# Altium project PCB_V2.0_Altium.PrjPcb
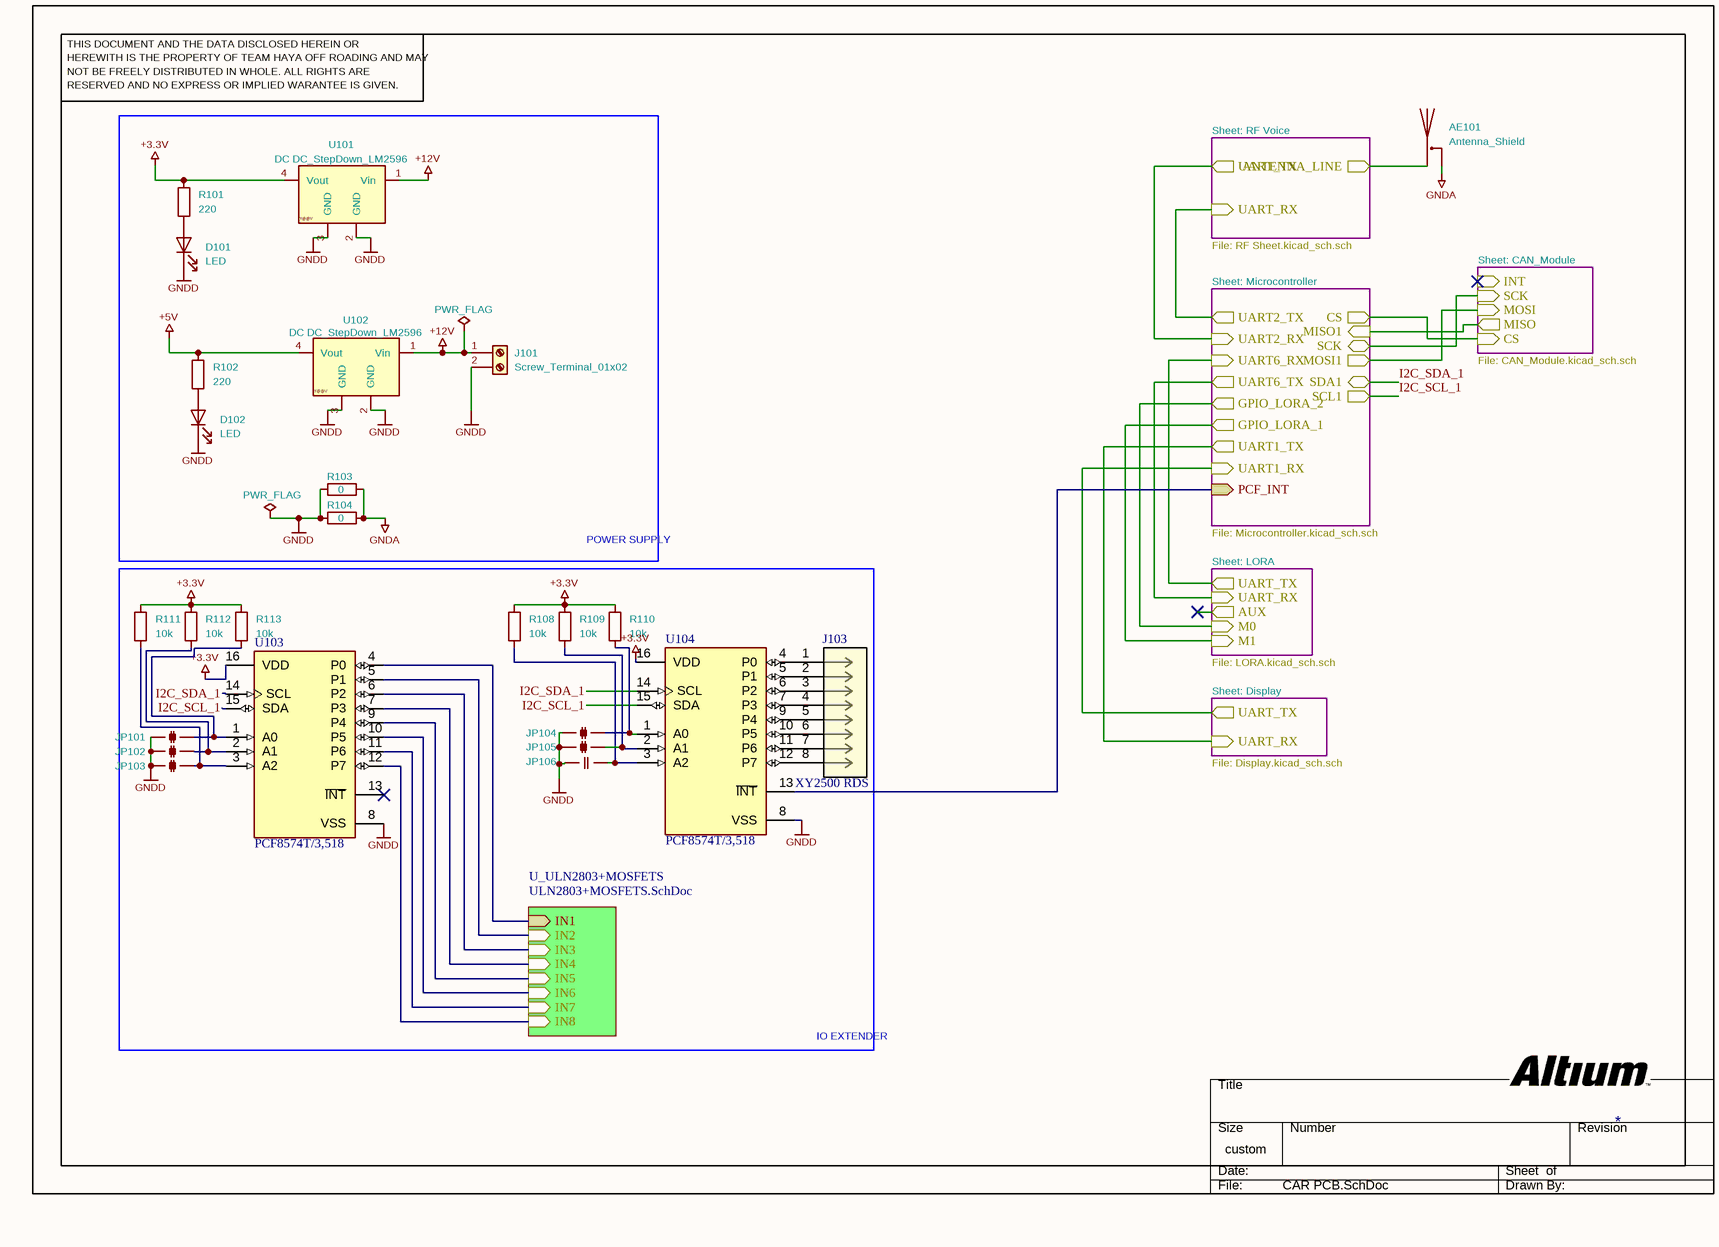
[diagram p0: CAR PCB.SchDoc]
7 sheets, 103 parts. Net scope: hierarchical (ports join the sheet entries above them; power ports are global).
Board file: PCBV2-01.PcbDoc
Sheets:
  CAR PCB.SchDoc
    Display = Display.SchDoc
    RF Voice = RF Sheet.SchDoc
    CAN_Module = CAN_Module.SchDoc
    LORA = LORA.SchDoc
    Microcontroller = Microcontroller.SchDoc
    U_ULN2803+MOSFETS = ULN2803+MOSFETS.SchDoc

## Sheet CAR PCB.SchDoc
size 297 x 209 mm

### Parts
#FLG0102  PWR_FLAG  (graphical)
#FLG0103  PWR_FLAG  (graphical)
AE101  Antenna_Shield  [132134_AMP]
D101  LED  [LED_1206_3216Metric_Pad1.42x1.75mm_HandSolder]
D102  LED  [LED_1206_3216Metric_Pad1.42x1.75mm_HandSolder]
J101  Screw_Terminal_01x02  [TerminalBlock_Phoenix_MKDS-3-2-5.08_1x02_P5.08mm_Horizontal]
J103  XY2500 RDS  [TerminalBlock_Phoenix_MKDS-1,5-8-5.08_1x08_P5.08mm_Horizontal]
JP101  SolderJumper_2_Bridged  [R_0603_1608Metric_Pad0.98x0.95mm_HandSolder]  (value not drawn)
JP102  SolderJumper_2_Bridged  [R_0603_1608Metric_Pad0.98x0.95mm_HandSolder]  (value not drawn)
JP103  SolderJumper_2_Bridged  [R_0603_1608Metric_Pad0.98x0.95mm_HandSolder]  (value not drawn)
JP104  SolderJumper_2_Bridged  [R_0603_1608Metric_Pad0.98x0.95mm_HandSolder]  (value not drawn)
JP105  SolderJumper_2_Bridged  [R_0603_1608Metric_Pad0.98x0.95mm_HandSolder]  (value not drawn)
JP106  SolderJumper_2_Open  [R_0603_1608Metric_Pad0.98x0.95mm_HandSolder]  (value not drawn)
R101  220  [R_0805_2012Metric_Pad1.20x1.40mm_HandSolder]
R102  220  [R_0805_2012Metric_Pad1.20x1.40mm_HandSolder]
R103  0  [R_1206_3216Metric_Pad1.30x1.75mm_HandSolder]
R104  0  [R_1206_3216Metric_Pad1.30x1.75mm_HandSolder]
R108  10k  [R_1206_3216Metric_Pad1.30x1.75mm_HandSolder]
R109  value 10k  [R_1206_3216Metric_Pad1.30x1.75mm_HandSolder]  (hidden comment: 1k)
R110  value 10k  [R_1206_3216Metric_Pad1.30x1.75mm_HandSolder]  (hidden comment: 1k)
R111  value 10k  [R_1206_3216Metric_Pad1.30x1.75mm_HandSolder]  (hidden comment: 1k)
R112  value 10k  [R_1206_3216Metric_Pad1.30x1.75mm_HandSolder]  (hidden comment: 1k)
R113  value 10k  [R_1206_3216Metric_Pad1.30x1.75mm_HandSolder]  (hidden comment: 1k)
U101  DC DC_StepDown_LM2596  [YAAJ_DCDC_StepDown_LM2596]
U102  DC DC_StepDown_LM2596  [YAAJ_DCDC_StepDown_LM2596]
U103  PCF8574T/3,518  [FP-SOT162-1-MFG]
U104  PCF8574T/3,518  [FP-SOT162-1-MFG]

### Blocks framed on the sheet
POWER SUPPLY: #FLG0102 #FLG0103 D101 D102 J101 R101-R104 U101 U102
IO EXTENDER: J103 JP101-JP106 R108-R113 U103 U104

### Sub-sheets
CAN_Module = CAN_Module.SchDoc: INT (in), SCK (in), MOSI (in), MISO (out), CS (in)
Display = Display.SchDoc: UART_TX (out), UART_RX (in)
LORA = LORA.SchDoc: AUX (out), UART_RX (in), UART_TX (out), M0 (in), M1 (in)
Microcontroller = Microcontroller.SchDoc: UART2_TX (out), UART2_RX (in), UART6_RX (in), UART6_TX (out), GPIO_LORA_2 (out), GPIO_LORA_1 (out), UART1_TX (out), UART1_RX (in), CS (out), MISO1 (in), SCK (bidir), MOSI1 (out), SDA1 (bidir), SCL1 (out), PCF_INT (in)
RF Voice = RF Sheet.SchDoc: UART_TX (out), UART_RX (in), ANTENNA_LINE (out)
U_ULN2803+MOSFETS = ULN2803+MOSFETS.SchDoc: IN3 (in), IN5 (in), IN2 (in), IN6 (in), IN8 (in), IN4 (in), IN7 (in), IN1 (in)

### Nets
+3.3V: R101.1 R108.1 R109.1 R110.1 R111.1 R112.1 R113.1 U101.4(Vout) U103.16(VDD) U104.16(VDD)
+5V: R102.1 U102.4(Vout)
+12V: #FLG0103.1 J101.1(Pin_1) U101.1(Vin) U102.1(Vin)
GNDA: AE101.2(Shield) R103.2 R104.2
GNDD: #FLG0102.1 D101.1(K) D102.1(K) J101.2(Pin_2) JP101.1(A) JP102.1(A) JP103.1(A) JP104.1(A) JP105.1(A) JP106.1(A) R103.1 R104.1 U101.2(GND) U101.3(GND) U102.2(GND) U102.3(GND) U103.8(VSS) U104.8(VSS)
ANTENNA_LINE: AE101.1(A) ; sheet RF Voice/ANTENNA_LINE
CS: sheet CAN_Module/CS, sheet Microcontroller/CS
GPIO_LORA_1: sheet LORA/M1, sheet Microcontroller/GPIO_LORA_1
GPIO_LORA_2: sheet LORA/M0, sheet Microcontroller/GPIO_LORA_2
I2C_SCL_1: U103.15(SDA) U104.15(SDA) ; sheet Microcontroller/SCL1
I2C_SDA_1: U103.14(SCL) U104.14(SCL) ; sheet Microcontroller/SDA1
IN1: U103.4(P0) ; sheet U_ULN2803+MOSFETS/IN1
IN2: U103.5(P1) ; sheet U_ULN2803+MOSFETS/IN2
IN3: U103.6(P2) ; sheet U_ULN2803+MOSFETS/IN3
IN4: U103.7(P3) ; sheet U_ULN2803+MOSFETS/IN4
IN5: U103.9(P4) ; sheet U_ULN2803+MOSFETS/IN5
IN6: U103.10(P5) ; sheet U_ULN2803+MOSFETS/IN6
IN7: U103.11(P6) ; sheet U_ULN2803+MOSFETS/IN7
IN8: U103.12(P7) ; sheet U_ULN2803+MOSFETS/IN8
MISO: sheet CAN_Module/MISO, sheet Microcontroller/MISO1
MOSI: sheet CAN_Module/MOSI, sheet Microcontroller/MOSI1
PCF_INT: U104.13(~{INT}) ; sheet Microcontroller/PCF_INT
SCK: sheet CAN_Module/SCK, sheet Microcontroller/SCK
UART1_RX: sheet Display/UART_TX, sheet Microcontroller/UART1_RX
UART1_TX: sheet Display/UART_RX, sheet Microcontroller/UART1_TX
UART2_RX: sheet RF Voice/UART_TX, sheet Microcontroller/UART2_RX
UART2_TX: sheet RF Voice/UART_RX, sheet Microcontroller/UART2_TX
UART6_RX: sheet LORA/UART_TX, sheet Microcontroller/UART6_RX
UART6_TX: sheet LORA/UART_RX, sheet Microcontroller/UART6_TX
NetD101_2: D101.2(A) R101.2
NetD102_2: D102.2(A) R102.2
NetJ103_1: J103.1 U104.4(P0)
NetJ103_2: J103.2 U104.5(P1)
NetJ103_3: J103.3 U104.6(P2)
NetJ103_4: J103.4 U104.7(P3)
NetJ103_5: J103.5 U104.9(P4)
NetJ103_6: J103.6 U104.10(P5)
NetJ103_7: J103.7 U104.11(P6)
NetJ103_8: J103.8 U104.12(P7)
NetJP101_2: JP101.2(B) R113.2 U103.1(A0)
NetJP102_2: JP102.2(B) R112.2 U103.2(A1)
NetJP103_2: JP103.2(B) R111.2 U103.3(A2)
NetJP104_2: JP104.2(B) R110.2 U104.1(A0)
NetJP105_2: JP105.2(B) R109.2 U104.2(A1)
NetJP106_2: JP106.2(B) R108.2 U104.3(A2)

Not connected (* = marked no-connect by the designer): U103 13(~{INT})*

### Notes on the sheet
- Sheet: RF Voice
- File: RF Sheet.kicad_sch.sch
- Sheet: Microcontroller
- Sheet: CAN_Module
- File: CAN_Module.kicad_sch.sch
- Sheet: LORA
- File: Microcontroller.kicad_sch.sch
- File: LORA.kicad_sch.sch
- Sheet: Display
- File: Display.kicad_sch.sch
- THIS DOCUMENT AND THE DATA DISCLOSED HEREIN OR
- HEREWITH IS THE PROPERTY OF TEAM HAYA OFF ROADING AND MAY
- NOT BE FREELY DISTRIBUTED IN WHOLE. ALL RIGHTS ARE
- RESERVED AND NO EXPRESS OR IMPLIED WARANTEE IS GIVEN.
- (in symbol DCDC_StepDown_LM2596) Y@@V

### Library data of the parts
J103 = 796867-8: No Description Available; Mfr_Name: TE Connectivity; TYPE: Header; RefDes: RefDes
R101-R104 R108-R113 = R
  R101 R102: Value: 220; Footprint: Resistor_SMD:R_0805_2012Metric_Pad1.20x1.40mm_HandSolder
  R103 R104: Value: 0; Footprint: Resistor_SMD:R_1206_3216Metric_Pad1.30x1.75mm_HandSolder
  R108: Value: 10k; Footprint: Resistor_SMD:R_1206_3216Metric_Pad1.30x1.75mm_HandSolder
  R109-R113: Footprint: Resistor_SMD:R_1206_3216Metric_Pad1.30x1.75mm_HandSolder
U101 U102 = DCDC_StepDown_LM2596: Value: DC DC_StepDown_LM2596; Footprint: DC DC Modules:DCDC_StepDown_LM2596
U103 U104 = CMP-10112-000010-1: IC I/O EXPANDER I2C 8B 16SOIC; Manufacturer: NXP Semiconductors; Frequency: 100kHz; Max Supply Voltage: 6V; Standoff Height: 0.1mm; Nominal Supply Current: 40uA; Max Junction Temp: +125°C; Min Supply Voltage: 2.5V; Number Of I/Os: 8; Manufacturer Part Number: PCF8574T/3,518; Footprint Url: https://www.nxp.com/docs/en/package-information/SOT162-1.pdf; ComponentLink2URL: https://www.nxp.com/docs/en/data-sheet/PCF8574_PCF8574A.pdf; Automotive: No; Digikey Description: IC I/O EXPANDER I2C 8B 16SOIC; Mouser Description: PCF8574 Series 2.5 - 6V Remote 8-bit I/O Expander for I2C-bus - SOIC-16; Ipc Land Pattern Name: SOIC127P1032X265-16; Interface: I2C; Octopart: https://octopart.com/pcf8574t%2F3%2C518-nxp+semiconductors-10470852; Ambient Temperature Range Low: -40°C; Lead Free: Yes; Device Class L2: Interface ICs; Temperature Range High: +85°C; Device Class L1: Integrated Circuits (ICs); Package: SOT162-1; ComponentLink2Description: Datasheet; Device Class L3: I/O Expanders; Temperature: -40°C to +85°C; Ambient Temperature Range High: +85°C; Height: 2.65mm; Category: IC; RoHS: TRUE; Temperature Range Low: -40°C
#FLG0102 #FLG0103 = PWR_FLAG: Value: PWR_FLAG
AE101 = Antenna_Shield: Value: Antenna_Shield; Footprint: Connector_Coaxial:SMA_Amphenol_132134-11_Vertical
D101 D102 = LED: Value: LED; Footprint: LED_SMD:LED_1206_3216Metric_Pad1.42x1.75mm_HandSolder
J101 = Screw_Terminal_01x02: Value: Screw_Terminal_01x02; Footprint: TerminalBlock_Phoenix:TerminalBlock_Phoenix_MKDS-3-2-5.08_1x02_P5.08mm_Horizontal
JP101-JP105 = SolderJumper_2_Bridged: Value: SolderJumper_2_Bridged
JP106 = SolderJumper_2_Open: Value: SolderJumper_2_Open

## Sheet Display.SchDoc
size 297 x 209 mm
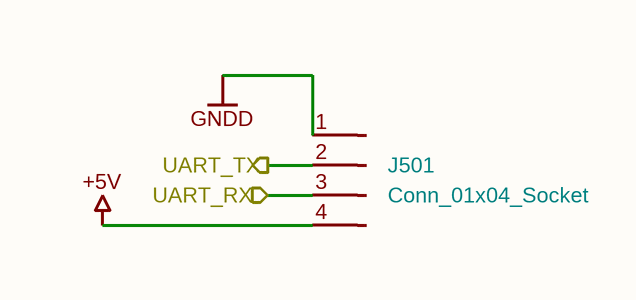
[diagram p1: Display.SchDoc]

### Parts
J501  Conn_01x04_Socket  [JST_XH_B4B-XH-A_1x04_P2.50mm_Vertical]

### Ports
UART_RX (in), UART_TX (out)

### Nets
+5V: J501.4(Pin_4)
GNDD: J501.1(Pin_1)
UART1_RX: J501.2(Pin_2) ; port UART_TX
UART1_TX: J501.3(Pin_3) ; port UART_RX

### Notes on the sheet
- THIS DOCUMENT AND THE DATA DISCLOSED HEREIN OR
- HEREWITH IS THE PROPERTY OF TEAM HAYA OFF ROADING AND MAY
- NOT BE FREELY DISTRIBUTED IN WHOLE. ALL RIGHTS ARE
- RESERVED AND NO EXPRESS OR IMPLIED WARANTEE IS GIVEN.

### Library data of the parts
J501 = Conn_01x04_Socket: Value: Conn_01x04_Socket; Footprint: Connector_JST:JST_XH_B4B-XH-A_1x04_P2.50mm_Vertical

## Sheet RF Sheet.SchDoc
size 297 x 209 mm
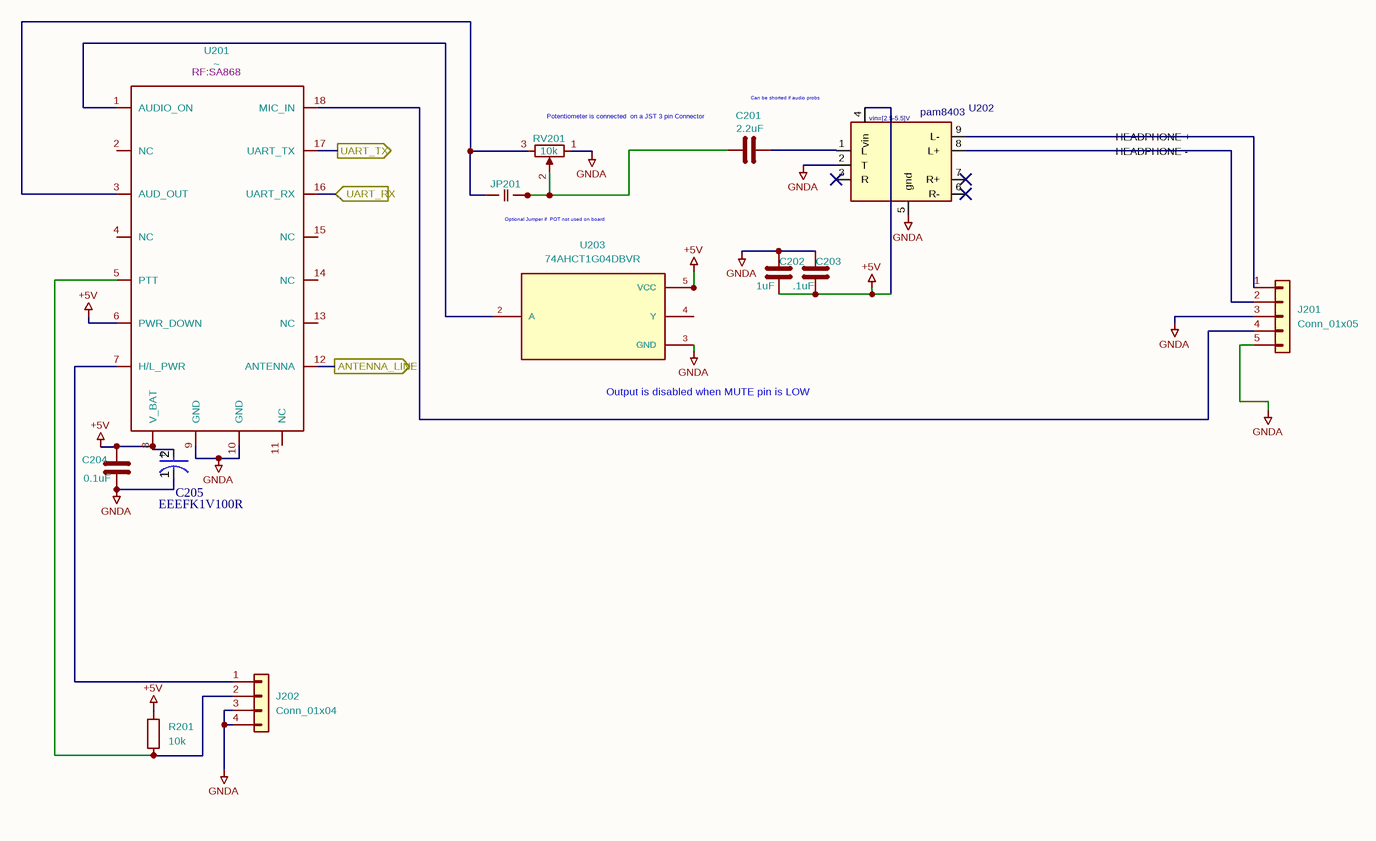
[diagram p2: RF Sheet.SchDoc]

### Parts
C201  2.2uF  [C_0603_1608Metric_Pad1.08x0.95mm_HandSolder]
C202  1uF  [C_0603_1608Metric_Pad1.08x0.95mm_HandSolder]
C203  .1uF  [C_0603_1608Metric_Pad1.08x0.95mm_HandSolder]
C204  0.1uF  [C_0603_1608Metric_Pad1.08x0.95mm_HandSolder]
C205  EEEFK1V100R  [FP-FKC-MFG]
J201  Conn_01x05  [JST_XH_B05B-XH-A_05x2.50mm_Straight]
J202  Conn_01x04  [JST_XH_B4B-XH-A_1x04_P2.50mm_Vertical]
JP201  SolderJumper_2_Open  [R_1206_3216Metric_Pad1.30x1.75mm_HandSolder]  (value not drawn)
R201  10k  [R_1206_3216Metric_Pad1.30x1.75mm_HandSolder]
RV201  10k  [JST_XH_B3B-XH-A_1x03_P2.50mm_Vertical]
U201  Footprint: RF:SA868  [SA868]  (hidden comment: ~)
U202  pam8403  [pam8403]
U203  74AHCT1G04DBVR  [SOT-23-5]

### Ports
ANTENNA_LINE (out), UART_RX (in), UART_TX (out)

### Nets
+5V: C202.2 C203.2 C204.1 C205.2(A) R201.1 U201.6(PWR_DOWN) U201.8(V_BAT) U202.4(vin) U203.5(VCC)
GNDA: C202.1 C203.1 C204.2 C205.1(C) J201.3(Pin_3) J201.5(Pin_5) J202.3(Pin_3) J202.4(Pin_4) RV201.1 U201.9(GND) U201.10(GND) U202.2(T) U202.5(gnd) U203.3(GND)
ANTENNA_LINE: U201.12(ANTENNA) ; port ANTENNA_LINE
UART2_RX: U201.17(UART_TX) ; port UART_TX
UART2_TX: U201.16(UART_RX) ; port UART_RX
NetC201_1: C201.1 JP201.2(B) RV201.2
NetC201_2: C201.2 U202.1(L)
NetJ201_1: J201.1(Pin_1) U202.9(L-)
NetJ201_2: J201.2(Pin_2) U202.8(L+)
NetJ201_4: J201.4(Pin_4) U201.18(MIC_IN)
NetJ202_1: J202.1(Pin_1) U201.7(H/L_PWR)
NetJ202_2: J202.2(Pin_2) R201.2 U201.5(PTT)
NetJP201_1: JP201.1(A) RV201.3 U201.3(AUD_OUT)
NetU201_1: U201.1(AUDIO_ON) U203.2(A)

Not connected (* = marked no-connect by the designer): U201 2(NC) 4(NC) 11(NC) 13(NC) 14(NC) 15(NC); U202 3(R)* 6(R-)* 7(R+)*; U203 4(Y)

### Notes on the sheet
- Potentiometer is connected
  on a JST 3 pin Connector
- Can be shorted
  if audio probs
- (near JP201) Optional Jumper if
  POT not used on board
- (near U203) Output is disabled when MUTE pin is LOW
- Labels drawn without touching a wire or pin: HEADPHONE +, HEADPHONE -
- THIS DOCUMENT AND THE DATA DISCLOSED HEREIN OR
- HEREWITH IS THE PROPERTY OF TEAM HAYA OFF ROADING AND MAY
- NOT BE FREELY DISTRIBUTED IN WHOLE. ALL RIGHTS ARE
- RESERVED AND NO EXPRESS OR IMPLIED WARANTEE IS GIVEN.
- (in symbol CMP-05427-000097-1) +
- (in symbol pam8403) vin=[2.5-5.5]V

### Library data of the parts
C201-C204 = C: Footprint: Capacitor_SMD:C_0603_1608Metric_Pad1.08x0.95mm_HandSolder
  C201: Value: 2.2uF
  C202: Value: 1uF
  C203: Value: .1uF
  C204: Value: 0.1uF
C205 = CMP-05427-000097-1: CAP ALUM 10UF 20% 35V SMD; Leakage Current: 3uA; Ripple Current: 160mA; Material: Aluminium; Impedance: 700mR; Life (Hours): 2000Hour; Radiation Hardening: No; Packaging: Tape and Reel; Construction: Cylindrical; Max Operating Temperature: 105°C; Contact Plating: Tin; Voltage Rating (DC): 35V; Series: FK; Tolerance: 20%; Voltage: 35V; RoHS Compliant: Yes; Capacitance: 10uF; Package Quantity: 1; Voltage Rating: 35V; Width: 6.5mm; ESR (Equivalent Series Resistance): 700mR; Lead Free: Lead Free; Number of Pins: 2; Height - Seated (Max): 0.228inch; Diameter: 5mm; Termination: SMD/SMT; Min Operating Temperature: -55°C; Ripple Current (AC): 160mA; Height: 5.8mm; Case/Package: Radial; Length: 5.8mm; Mount: Surface Mount
R201 = R: Value: 10k; Footprint: Resistor_SMD:R_1206_3216Metric_Pad1.30x1.75mm_HandSolder
RV201 = R_Potentiometer: Value: 10k; Footprint: Connector_JST:JST_XH_B3B-XH-A_1x03_P2.50mm_Vertical
U201 = SA868: Value: ~
U203 = 74AHCT1G04DBVR: MF: Texas Instruments; MP: SN74AHCT1G04DBVR; Value: 74AHCT1G04DBVR; Footprint: Package_TO_SOT_SMD:SOT-23-5
J201 = Conn_01x05: Value: Conn_01x05; Footprint: Connector_JST:JST_XH_B5B-XH-A_1x05_P2.50mm_Vertical
J202 = Conn_01x04: Value: Conn_01x04; Footprint: Connector_JST:JST_XH_B4B-XH-A_1x04_P2.50mm_Vertical
JP201 = SolderJumper_2_Open: Value: SolderJumper_2_Open; Footprint: Resistor_SMD:R_1206_3216Metric_Pad1.30x1.75mm_HandSolder
U202 = pam8403: Value: pam8403

## Sheet CAN_Module.SchDoc
size 297 x 209 mm
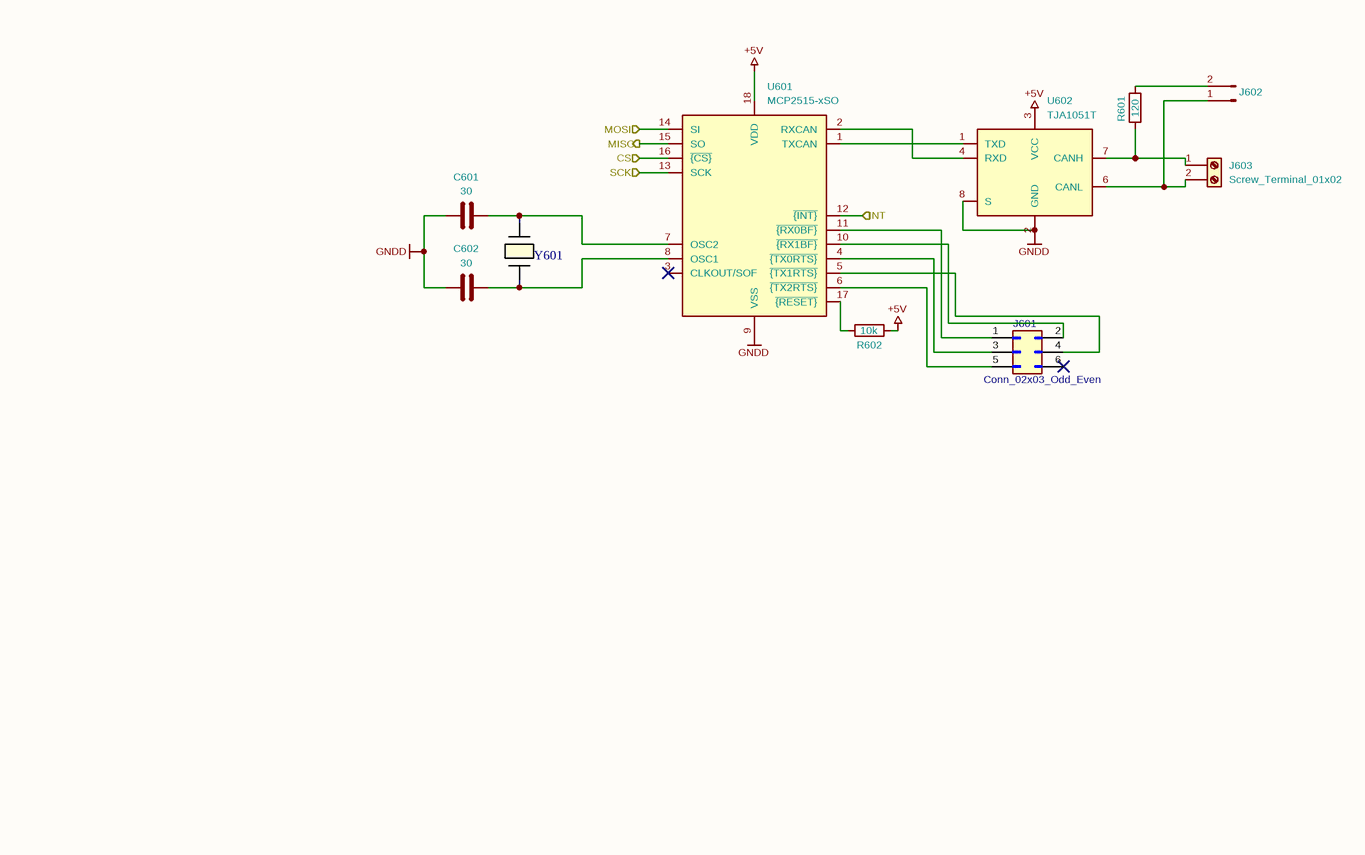
[diagram p3: CAN_Module.SchDoc]

### Parts
C601  30  [C_0402_1005Metric_Pad0.74x0.62mm_HandSolder]
C602  30  [C_0402_1005Metric_Pad0.74x0.62mm_HandSolder]
J601  Conn_02x03_Odd_Even  [PinHeader_2x03_P2.54mm_Vertical]
J602  Conn_01x02_Pin  [PinHeader_1x02_P2.54mm_Vertical]  (value not drawn)
J603  Screw_Terminal_01x02  [TerminalBlock_Xinya_XY308-2.54-2P_1x02_P2.54mm_Horizontal]
R601  120  [R_0603_1608Metric_Pad0.98x0.95mm_HandSolder]
R602  10k  [R_0603_1608Metric_Pad0.98x0.95mm_HandSolder]
U601  MCP2515-xSO  [SOIC-SO18_M]
U602  TJA1051T  [NXP-SOIC-8_M]
Y601  X49SM8MSD2SC  [H32_RAM]  (value not drawn)

### Ports
CS (in), INT (in), MISO (out), MOSI (in), SCK (in)

### Nets
+5V: R602.2 U601.18(VDD) U602.3(VCC)
GNDD: C601.1 C602.1 U601.9(VSS) U602.2(GND) U602.8(S)
CS: U601.16(~{{CS}}) ; port CS
INT: U601.12(~{{INT}}) ; port INT
MISO: U601.15(SO) ; port MISO
MOSI: U601.14(SI) ; port MOSI
SCK: U601.13(SCK) ; port SCK
NetC601_2: C601.2 U601.7(OSC2) Y601.1
NetC602_2: C602.2 U601.8(OSC1) Y601.2
NetJ601_1: J601.1(Pin_1) U601.11(~{{RX0BF}})
NetJ601_2: J601.2(Pin_2) U601.10(~{{RX1BF}})
NetJ601_3: J601.3(Pin_3) U601.4(~{{TX0RTS}})
NetJ601_4: J601.4(Pin_4) U601.5(~{{TX1RTS}})
NetJ601_5: J601.5(Pin_5) U601.6(~{{TX2RTS}})
NetJ602_1: J602.1(Pin_1) J603.2(Pin_2) U602.6(CANL)
NetJ602_2: J602.2(Pin_2) R601.1
NetJ603_1: J603.1(Pin_1) R601.2 U602.7(CANH)
NetR602_1: R602.1 U601.17(~{{RESET}})
NetU601_1: U601.1(TXCAN) U602.1(TXD)
NetU601_2: U601.2(RXCAN) U602.4(RXD)

Not connected (* = marked no-connect by the designer): J601 6(Pin_6)*; U601 3(CLKOUT/SOF)*; U602 5(NC)

### Notes on the sheet
- THIS DOCUMENT AND THE DATA DISCLOSED HEREIN OR
- HEREWITH IS THE PROPERTY OF TEAM HAYA OFF ROADING AND MAY
- NOT BE FREELY DISTRIBUTED IN WHOLE. ALL RIGHTS ARE
- RESERVED AND NO EXPRESS OR IMPLIED WARANTEE IS GIVEN.

### Library data of the parts
C601 C602 = C: Value: 30; Footprint: Capacitor_SMD:C_0402_1005Metric_Pad0.74x0.62mm_HandSolder
J601 = Conn_02x03_Odd_Even: Generic connector, double row, 02x03, odd/even pin numbering scheme (row 1 odd numbers, row 2 even numbers), script generated (kicad-library-utils/schlib/autogen/connector/); ki_fp_filters: Connector*:*_2x??_*; Value: Conn_02x03_Odd_Even; Datasheet: ~; Description_: Generic connector, double row, 02x03, odd/even pin numbering scheme (row 1 odd numbers, row 2 even numbers), script generated (kicad-library-utils/schlib/autogen/connector/); ki_keywords: connector
R601 R602 = R: Footprint: Resistor_SMD:R_0603_1608Metric_Pad0.98x0.95mm_HandSolder
  R601: Value: 120
  R602: Value: 10k
Y601 = HC49US-10.244MHZ-16PF-30-EXT-SMD-H32-TR: https://sharvielectronics.com/product/hc-49smd-8mhz-surface-mount-crystal-20pf-oscillator-x49sm8msd2sc/\; Mfr_Name: Rami Technology
J602 = Conn_01x02_Pin: Value: Conn_01x02_Pin
J603 = Screw_Terminal_01x02: Value: Screw_Terminal_01x02
U601 = MCP2515-xSO: Value: MCP2515-xSO; Footprint: Package_SO:SOIC-18W_7.5x11.6mm_P1.27mm
U602 = TJA1051T: Value: TJA1051T; Footprint: Package_SO:SOIC-8_3.9x4.9mm_P1.27mm

## Sheet LORA.SchDoc
size 297 x 209 mm
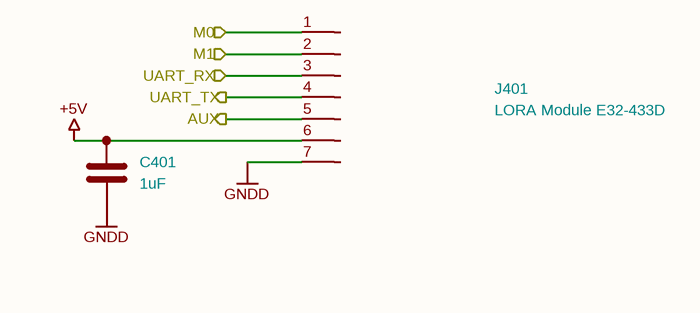
[diagram p4: LORA.SchDoc]

### Parts
C401  1uF  [C_0603_1608Metric_Pad1.08x0.95mm_HandSolder]
J401  LORA Module E32-433D  [E32-433T33D-EDITEDSIZE]

### Ports
AUX (out), M0 (in), M1 (in), UART_RX (in), UART_TX (out)

### Nets
+5V: C401.1 J401.6(Pin_6)
GNDD: C401.2 J401.7(Pin_7)
AUX: J401.5(Pin_5) ; port AUX
GPIO_LORA_1: J401.2(Pin_2) ; port M1
GPIO_LORA_2: J401.1(Pin_1) ; port M0
UART6_RX: J401.4(Pin_4) ; port UART_TX
UART6_TX: J401.3(Pin_3) ; port UART_RX

### Notes on the sheet
- THIS DOCUMENT AND THE DATA DISCLOSED HEREIN OR
- HEREWITH IS THE PROPERTY OF TEAM HAYA OFF ROADING AND MAY
- NOT BE FREELY DISTRIBUTED IN WHOLE. ALL RIGHTS ARE
- RESERVED AND NO EXPRESS OR IMPLIED WARANTEE IS GIVEN.

### Library data of the parts
C401 = C: Value: 1uF; Footprint: Capacitor_SMD:C_0603_1608Metric_Pad1.08x0.95mm_HandSolder
J401 = Conn_01x07_Socket: Value: LORA Module E32-433D; Footprint: LORA Modules:E32-433T33D

## Sheet Microcontroller.SchDoc
size 297 x 209 mm
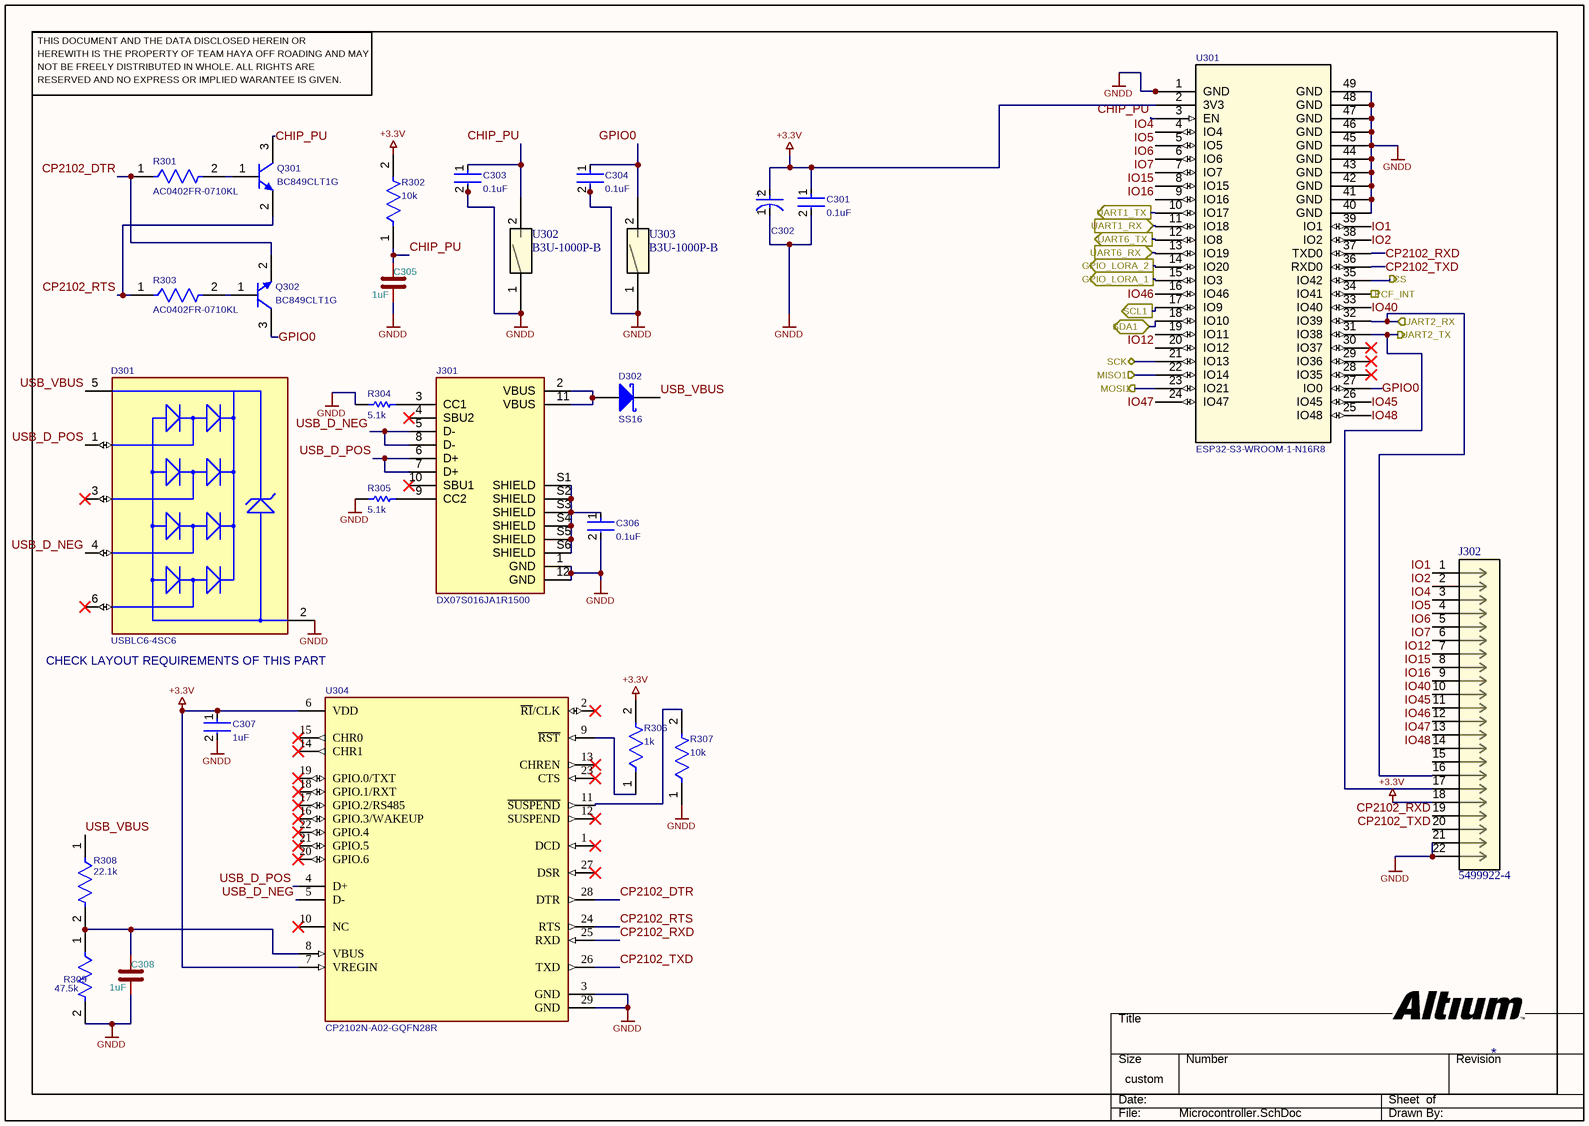
[diagram p5: Microcontroller.SchDoc]

### Parts
C301  0.1uF  [FP-CC0402-MFG]
C302  EEEFK1V100R  [FP-FKC-MFG]  (value not drawn)
C303  0.1uF  [FP-CC0402-MFG]
C304  0.1uF  [FP-CC0402-MFG]
C305  1uF  [C_0603_1608Metric_Pad1.08x0.95mm_HandSolder]
C306  0.1uF  [FP-CC0402-MFG]
C307  1uF  [FP-CC0603-DA-MFG]
C308  1uF  [C_0603_1608Metric_Pad1.08x0.95mm_HandSolder]
D301  USBLC6-4SC6  [FP-SOT23-6L-MFG]
D302  SS16  [FAIR-SMA-2_B_V]
J301  DX07S016JA1R1500  [JAE_DX07S016JA1R1500]
J302  5499922-4  [CON20_2X10_SHM_TEC]
Q301  BC849CLT1G  [ONSC-SOT-23-3-318-08_V]
Q302  BC849CLT1G  [ONSC-SOT-23-3-318-08_V]
R301  AC0402FR-0710KL  [FP-AC0402-MFG]
R302  10k  [FP-RC0603-0_55-IPC_C]
R303  AC0402FR-0710KL  [FP-AC0402-MFG]
R304  5.1k  [RESC1005X40X25NL05T10]
R305  5.1k  [RESC1005X40X25NL05T10]
R306  1k  [FP-RC0402-0_4-IPC_A]
R307  10k  [FP-RC0603-0_55-IPC_C]
R308  22.1k  [FP-RMCF0603-IPC_C]
R309  47.5k  [FP-AC0603-MFG]
U301  ESP32-S3-WROOM-1-N16R8  [ESP32-S3-WROOM-1_EXP]
U302  B3U-1000P-B  [B3U-1000P-B]
U303  B3U-1000P-B  [B3U-1000P-B]
U304  CP2102N-A02-GQFN28R  [FP-CP2102N-A02-GQFN28R-MFG]

### Ports
CS (out), GPIO_LORA_1 (out), GPIO_LORA_2 (out), MISO1 (in), MOSI1 (out), PCF_INT (out), SCK (bidir), SCL1 (out), SDA1 (bidir), UART1_RX (in), UART1_TX (out), UART2_RX (in), UART2_TX (out), UART6_RX (in), UART6_TX (out)

### Nets
+3.3V: C301.1 C302.2(A) C307.1 J302.18 R302.2 R306.2 U301.2(3V3) U304.6(VDD) U304.7(VREGIN)
GNDD: C301.2 C302.1(C) C303.2 C304.2 C305.2 C306.2 C307.2 C308.2 D301.2(GND) J301.1(GND) J301.12(GND) J302.21 J302.22 R304.1 R305.1 R307.1 R309.2 U301.1(GND) U301.40(GND) U301.41(GND) U301.42(GND) U301.43(GND) U301.44(GND) U301.45(GND) U301.46(GND) U301.47(GND) U301.48(GND) U301.49(GND) U302.1 U303.1 U304.3(GND) U304.29(GND)
CHIP_PU: C303.1 C305.1 Q301.3(C) R302.1 U301.3(EN) U302.2
CP2102_DTR: Q302.2(E) R301.1 U304.28(DTR)
CP2102_RTS: Q301.2(E) R303.1 U304.24(RTS)
CP2102_RXD: J302.19 U301.37(TXD0) U304.25(RXD)
CP2102_TXD: J302.20 U301.36(RXD0) U304.26(TXD)
CS: U301.35(IO42) ; port CS
GPIO0: C304.1 Q302.3(C) U301.27(IO0) U303.2
GPIO_LORA_1: U301.15(IO3) ; port GPIO_LORA_1
GPIO_LORA_2: U301.14(IO20) ; port GPIO_LORA_2
I2C_SCL_1: U301.17(IO9) ; port SCL1
I2C_SDA_1: U301.18(IO10) ; port SDA1
IO1: J302.1 U301.39(IO1)
IO2: J302.2 U301.38(IO2)
IO4: J302.3 U301.4(IO4)
IO5: J302.4 U301.5(IO5)
IO6: J302.5 U301.6(IO6)
IO7: J302.6 U301.7(IO7)
IO12: J302.7 U301.20(IO12)
IO15: J302.8 U301.8(IO15)
IO16: J302.9 U301.9(IO16)
IO40: J302.10 U301.33(IO40)
IO45: J302.11 U301.26(IO45)
IO46: J302.12 U301.16(IO46)
IO47: J302.13 U301.24(IO47)
IO48: J302.14 U301.25(IO48)
MISO: U301.22(IO14) ; port MISO1
MOSI: U301.23(IO21) ; port MOSI1
PCF_INT: U301.34(IO41) ; port PCF_INT
SCK: U301.21(IO13) ; port SCK
UART1_RX: U301.11(IO18) ; port UART1_RX
UART1_TX: U301.10(IO17) ; port UART1_TX
UART2_RX: J302.16 U301.32(IO39) ; port UART2_RX
UART2_TX: J302.17 U301.31(IO38) ; port UART2_TX
UART6_RX: U301.13(IO19) ; port UART6_RX
UART6_TX: U301.12(IO8) ; port UART6_TX
USB_D_NEG: D301.4(I/O3) J301.5(D-) J301.8(D-) U304.5(D-)
USB_D_POS: D301.1(I/O1) J301.6(D+) J301.7(D+) U304.4(D+)
USB_VBUS: D301.5(VBUS) D302.2(K) R308.1
NetC306_1: C306.1 J301.S1(SHIELD) J301.S2(SHIELD) J301.S3(SHIELD) J301.S4(SHIELD) J301.S5(SHIELD) J301.S6(SHIELD)
NetC308_1: C308.1 R308.2 R309.1 U304.8(VBUS)
NetD302_1: D302.1(A) J301.2(VBUS) J301.11(VBUS)
NetJ301_3: J301.3(CC1) R304.2
NetJ301_9: J301.9(CC2) R305.2
NetQ301_1: Q301.1(B) R301.2
NetQ302_1: Q302.1(B) R303.2
NetR306_1: R306.1 U304.9(~{RST})
NetR307_2: R307.2 U304.11(~{SUSPEND})

Not connected (* = marked no-connect by the designer): D301 3(I/O2)* 6(I/O4)*; J301 4(SBU2)* 10(SBU1)*; J302 15; U301 19(IO11) 28(IO35)* 29(IO36)* 30(IO37)*; U304 1(DCD)* 2(~{RI}/CLK)* 10(NC)* 12(SUSPEND)* 13(CHREN)* 14(CHR1)* 15(CHR0)* 16(GPIO.3/WAKEUP)* 17(GPIO.2/RS485)* 18(GPIO.1/RXT)* 19(GPIO.0/TXT)* 20(GPIO.6)* 21(GPIO.5)* 22(GPIO.4)* 23(CTS)* 27(DSR)*

### Notes on the sheet
- CHECK LAYOUT REQUIREMENTS OF THIS PART
- THIS DOCUMENT AND THE DATA DISCLOSED HEREIN OR
- HEREWITH IS THE PROPERTY OF TEAM HAYA OFF ROADING AND MAY
- NOT BE FREELY DISTRIBUTED IN WHOLE. ALL RIGHTS ARE
- RESERVED AND NO EXPRESS OR IMPLIED WARANTEE IS GIVEN.
- (in symbol CMP-05427-000097-1) +

### Library data of the parts
C301 C303 C304 C306 = CMP-03422-001010-1: CAP CER 0.1UF 50V X7R 0402 / CC0402KRX7R9BB104; Manufacturer: YAGEO; Capacitance: 100 nF; Temperature Coefficient: 30ppm/°C; Material: Ceramic; Value: 100 nF; Automotive Grade: NA; Tolerance: 0.1; Footprint Url: http://www.yageo.com/exep/pages/download/literatures/UPY-C_GEN_24.pdf; Category: Cap; Package: CC0402; Voltage Rating: 50 V; ComponentLink2Description: Datasheet; Temperature Characteristic: X7R; Device Class L1: Passive Components; Device Class L2: Capacitors; Digikey Description: CAP CER 0.1UF 50V X7R 0402; Octopart: https://octopart.com/cc0402krx7r9bb104-yageo-56536067; Device Class L3: Ceramic Capacitors; Height: 0.55mm; Temperature: -55°C to +125°C; Temperature Range High: +125°C; ComponentLink2URL: http://www.yageo.com/documents/recent/UPY-GP_NP0_16V-to-50V_16.pdf; Temperature Range Low: -55°C; RoHS: TRUE; Ipc Land Pattern Name: CAPC10050X50; Lead Free: Yes; Automotive: No; Manufacturer Part Number: CC0402KRX7R9BB104
C302 = CMP-05427-000097-1: as C205 on sheet RF Sheet; Radiation Hardening: No; Packaging: Tape and Reel; Construction: Cylindrical; Max Operating Temperature: 105°C; Contact Plating: Tin; Voltage Rating (DC): 35V; Series: FK; Tolerance: 20%; Voltage: 35V; RoHS Compliant: Yes; Capacitance: 10uF; Package Quantity: 1; Voltage Rating: 35V; Width: 6.5mm; ESR (Equivalent Series Resistance): 700mR; Lead Free: Lead Free; Number of Pins: 2; Height - Seated (Max): 0.228inch; Diameter: 5mm; Termination: SMD/SMT; Min Operating Temperature: -55°C; Ripple Current (AC): 160mA; Height: 5.8mm; Case/Package: Radial; Length: 5.8mm; Mount: Surface Mount
C305 C308 = C: CC0603KRX7R0BB105; Value: 1uF; Footprint: Capacitor_SMD:C_0603_1608Metric_Pad1.08x0.95mm_HandSolder
C307 = CMP-03422-000924-1: CAP CER 1UF 16V X7R 0603; Manufacturer: YAGEO; Manufacturer Part Number: CC0603KRX7R7BB105; Tolerance: 0.1; Temperature Coefficient: 15%; Material: Ceramic; Package: CC0603-DA; RoHS: TRUE; Device Class L2: Capacitors; Temperature Characteristic: X7R; Temperature: -55°C to +125°C; Temperature Range Low: -55°C; Automotive: No; ComponentLink2Description: Datasheet; Value: 1 uF; Lead Free: Yes; Capacitance: 1 uF; ComponentLink2URL: http://www.yageo.com/documents/recent/UPY-GPHC_X7R_6.3V-to-50V_18.pdf; Device Class L1: Passive Components; Voltage: 16 V; Octopart: https://octopart.com/cc0603krx7r7bb105-yageo-42271928; Category: Cap; Digikey Description: CAP CER 1UF 16V X7R 0603; Footprint Url: http://www.yageo.com/exep/pages/download/literatures/UPY-C_GEN_24.pdf; Height: 0.9mm; Voltage Rating: 16 V; Temperature Range High: +125°C; Mouser Description: Multilayer Ceramic Capacitor, CC Series, 1 - F, - 10%, X7R, 16 V, 0603 [1608 Metric]; Device Class L3: Ceramic Capacitors
D301 = CMP-2000-07370-2: TVS DIODE 5.25V 17V SOT23-6; Manufacturer: STMicroelectronics; Peak Pulse Power: 130W; Breakdown Voltage: 6V; Value: 3pF; Direction: Unidirectional; Interface: USB,Ethernet,Other; Number Of Channels: 4; Standoff Height: 0mm; Max Junction Temp: +125°C; Digikey Description: TVS DIODE 5.25V 17V SOT23-6; Automotive: No; Package: SOT23-6L; Mouser Description: USBLC6 Series 4 Line 6 V Uni / Bi-Directional ESD Protection - SOT-23-6; Octopart: https://octopart.com/usblc6-4sc6-stmicroelectronics-347147; RoHS: TRUE; ComponentLink2URL: https://upverter.com/datasheet/23dc4ffb028d868909e80577610284b194f13213.pdf; ComponentLink2Description: Datasheet; Device Class L1: Circuit Protection; Lead Free: Yes; Temperature Range High: +125°C; Device Class L2: ESD and Circuit Protection ICs; Device Class L3: unset; Capacitance: 3pF; Height: 1.45mm; Temperature Range Low: -40°C; Manufacturer Part Number: USBLC6-4SC6; Temperature: -40°C to +125°C; Category: Diode; Clamping Voltage: 17V
D302 = CMP-2000-07149-1: Schottky Rectifier, 700 mV, -65 to 125 degC, 2-Pin SMA, RoHS, Tape and Reel; Manufacturer: FairchildSemiconductor; Type: SchottkyDiode; Peak Average Forward Current: 1@Ta=75CA; Peak Reverse Current: 200uA; Peak Non-Repetitive Surge Current: 40A; Configuration: Single; Peak Forward Voltage: 0.7V; Peak Reverse Repetitive Voltage: 60V; Package: 2DO-214AC; Datasheet URL: http://www.mouser.com/ds/2/149/SS16-196707.pdf; Package Description: 2-Pin Surface Mount Device, Body 4.375 x 2.725 mm; Packaging: Tape&Reel; Package Reference: SMA-2; Mounting: SurfaceMount; Operating Temperature: -65to125°C; Datasheet Version: Rev. 1.9, 01/2015; Mounting Technology: SurfaceMount; Category: Rectifier; Manufacturer URL: https://www.fairchildsemi.com/
J301 = DX07S016JA1R1500: USB-C (USB TYPE-C) USB 2.0 Receptacle Connector 24 (16+8 Dummy) Position Surface Mount, Right Angle; Through Hole; Package: None; Value: *; Price: None; MP: DX07S016JA1R1500; Availability: Unavailable
J302 = 5499922-4: No Description Available; Mfr_Name: TE Connectivity; RefDes: RefDes; Type: Type
Q301 Q302 = CMP-1048-00726-1: General Purpose Transistor, NPN Silicon, 3-Pin SOT-23, Pb-Free, Tape and Reel; Manufacturer: On Semiconductor; fT Min (MHz): 100; IC Continuous (A): 0.1; ComponentLink3Description: Package Specification; Mounting Technology: Surface Mount; ComponentLink3URL: http://www.onsemi.cn/pub_link/Collateral/318-08.PDF; PartNumber: BC849CLT1G; Polarity: NPN; ComponentLink2URL: http://www.onsemi.cn/pub_link/Collateral/BC846ALT1-D.PDF; PackageDescription: 3-Pin Small Outline Transistor, Body 2.92 x 1.3 mm, Pitch 0.95 mm; PackageReference: SOT-23-3-318-08; DatasheetVersion: Rev. 11; RoHS: TRUE; Packing: Tape and Reel; ComponentLink1Description: Manufacturer URL; ComponentLink2Description: Datasheet; ComponentLink1URL: http://www.onsemi.com/; PackageVersion: Rev. AP, 11/2009
R301 R303 = CMP-2002-01790-3: RES 10kΩ ±1% 0.063W 0402; Power Rating: 62.5mW; Voltage Rating: 50V; Temperature Coefficient: 100ppm/°C; Resistance: 10kR; Max Power Dissipation: 63mW; Tolerance: 1%; Military Standard: Not; Construction: Rectangular; Termination: SMD/SMT; Max Operating Temperature: 155°C; Min Operating Temperature: -55°C; Height: 0.015inch; Lead Free: Lead Free; Width: 0.02inch; Case/Package: 0402; Resistor Type: Thick Film; Series: AC; Features: Moisture Resistant; RoHS Compliant: Yes; Number of Terminations: 2; Case Code (Metric): 1005; Length: 0.039inch; Depth: 0.5mm; Size Code: 0402; Packaging: Tape and Reel; Case Code (Imperial): 0402
R302 R307 = CMP-2100-03664-2: RES 10K OHM 1% 1/10W 0603 / RC0603FR-0710KL; Voltage Rating: 75V; Voltage Rating (DC): 50V; Resistance: 10kR; Power Rating: 100mW; Temperature Coefficient: 100ppm/°C; Depth: 0.8mm; Termination: SMD/SMT; Resistor Type: Thick Film; Series: RC; Construction: Rectangular; Features: Moisture Resistant; Packaging: Tape and Reel; Min Operating Temperature: -55°C; Number of Terminations: 2; Lead Pitch: 0.3mm; RoHS Compliant: Yes; Case/Package: 0603; Resistance Tolerance: 1%; Military Standard: Not; Weight: 7.1E-05oz; Number of Pins: 2; Tolerance: 1%; Length: 1.6mm; Case Code (Imperial): 0603; Lead Free: Lead Free; Width: 0.8mm; Max Power Dissipation: 100mW; Height: 0.45mm; Max Operating Temperature: 155°C; Case Code (Metric): 1608; Size Code: 0603
R304 R305 = CMP-2002-07753-1: RC0402FR-075K1L; Manufacturer: Yageo / Phycomp; Part Number: RC0402FR-075K1L
R306 = CMP-2002-07472-3: RES 1K OHM 1% 1/16W 0402 / RC0402FR-071KL; Max Power Dissipation: 63mW; Resistance: 1kR; Voltage Rating (DC): 50V; Temperature Coefficient: 100ppm/°C; Power Rating: 62.5mW; Technology: THICK FILM; Size Code: 0402; Series: RC; Length: 1mm; Case/Package: 0402; Features: Moisture Resistant; Termination: SMD/SMT; Case Code (Metric): 1005; Reach SVHC Compliant: Yes; Number of Terminations: 2; Tolerance: 1%; Lead Free: Lead Free; Military Standard: Not; Resistor Type: Thick Film; Max Operating Temperature: 155°C; RoHS Compliant: Yes; Construction: Rectangular; Voltage Rating: 50V; Packaging: Tape and Reel; Height: 0.32mm; Number of Pins: 2; Resistance Tolerance: 1%; Case Code (Imperial): 0402; Depth: 0.5mm; Min Operating Temperature: -55°C; Width: 0.5mm
R308 = CMP-26527-005902-1: 22.1kΩ ±1% 0.1W 0603 Thick Film Chip Resistor AEC-Q200 compliant / RMCF0603FT22K1; Resistance: 22.1kR; Max Power Dissipation: 100mW; Temperature Coefficient: 100ppm/°C; Contact Plating: Tin; Size Code: 0603; Number of Terminations: 2; Series: RMCF; Mount: Surface Mount; Lead Free: Lead Free; Min Operating Temperature: -55°C; Height: 0.022inch; Resistor Type: Thick Film; Case Code (Metric): 1608; Case/Package: 0603; Packaging: Tape and Reel; Features: Automotive AEC-Q200; Power Rating: 100mW; Length: 0.061inch; Construction: Rectangular; Width: 0.031inch; Package Quantity: 1; Radiation Hardening: No; Military Standard: Not; Case Code (Imperial): 0603; RoHS Compliant: Yes; Tolerance: 1%; Depth: 0.8mm; Max Operating Temperature: 155°C
R309 = CMP-03412-027829-2: RES 47.5KΩ 1.00% 0.1W 0603 / AC0603FR-0747K5L; Tolerance: 1%; Temperature Coefficient: 100ppm/°C; Resistance: 47.5kR; Voltage Rating: 50V; Power Rating: 100mW; RoHS Compliant: Yes; Case Code (Metric): 1608; Series: AC; Features: Moisture Resistant; Width: 0.8mm; Case Code (Imperial): 0603; Packaging: Tape and Reel; Termination: SMD/SMT; Number of Terminations: 2; Max Operating Temperature: 155°C; Case/Package: 0603; Resistor Type: Thick Film; Min Operating Temperature: -55°C; Height: 0.022inch; Ratings: AEC-Q200; Length: 0.063inch; Max Power Dissipation: 100mW
U301 = ESP32-S3-WROOM-1-N16R8: No Description Available; Mfr_Name: Espressif Systems; RefDes: RefDes; Type: Type
U302 U303 = B3U-1000P-B: No Description Available; Mfr_Name: Omron; RefDes: RefDes; Type: Type
U304 = CMP-08093-000007-1: IC USB TO UART BRIDGE QFN28

## Sheet ULN2803+MOSFETS.SchDoc
size 297 x 209 mm
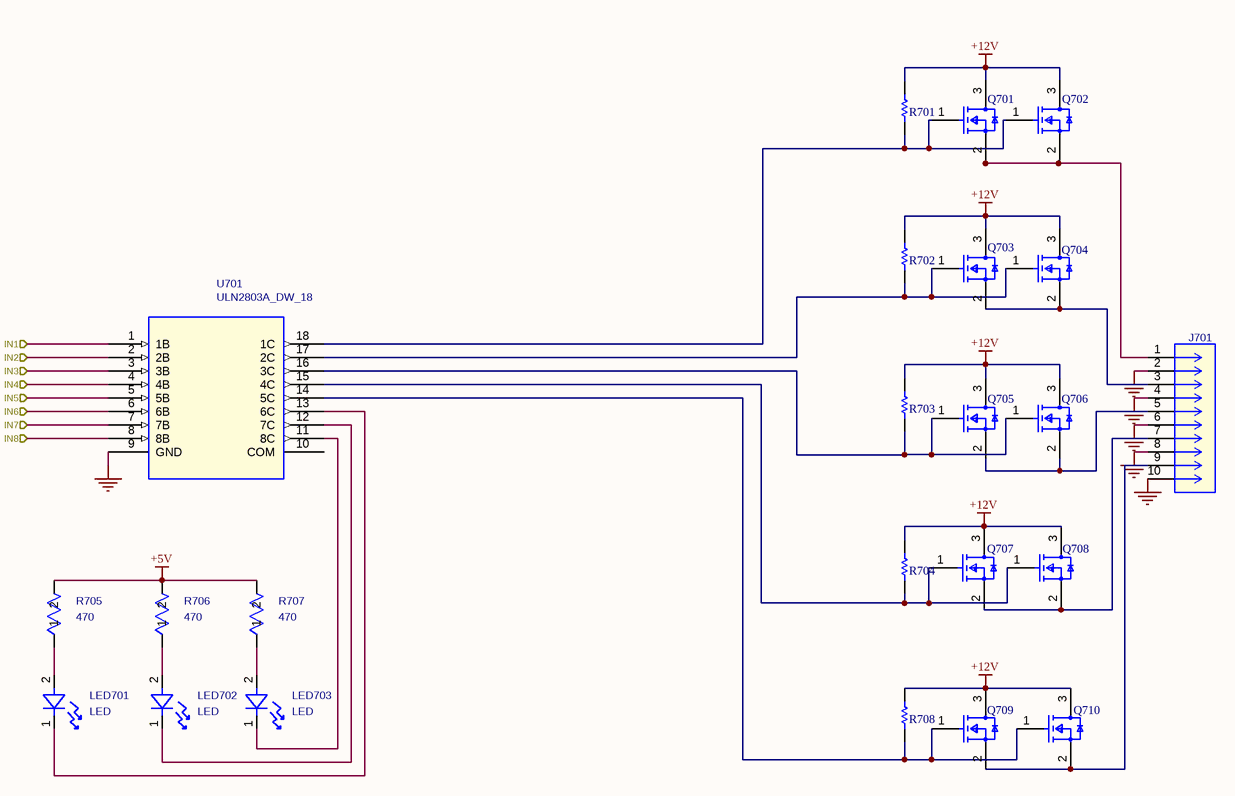
[diagram p6: ULN2803+MOSFETS.SchDoc]

### Parts
J701  CONN_1924389  [TerminalBlock_Phoenix_MKDS-3-10-5.08_1x10_P5.08mm_Horizontal]  (value not drawn)
LED701  LED  [LED_0805_2012Metric_Pad1.15x1.40mm_HandSolder]
LED702  LED  [LED_0805_2012Metric_Pad1.15x1.40mm_HandSolder]
LED703  LED  [LED_0805_2012Metric_Pad1.15x1.40mm_HandSolder]
Q701  3b9c635fedb024a5347a57b145af9cc  [FP-S-03946-IPC_C]  (value not drawn)
Q702  3b9c635fedb024a5347a57b145af9cc  [FP-S-03946-IPC_C]  (value not drawn)
Q703  3b9c635fedb024a5347a57b145af9cc  [FP-S-03946-IPC_C]  (value not drawn)
Q704  3b9c635fedb024a5347a57b145af9cc  [FP-S-03946-IPC_C]  (value not drawn)
Q705  3b9c635fedb024a5347a57b145af9cc  [FP-S-03946-IPC_C]  (value not drawn)
Q706  3b9c635fedb024a5347a57b145af9cc  [FP-S-03946-IPC_C]  (value not drawn)
Q707  3b9c635fedb024a5347a57b145af9cc  [FP-S-03946-IPC_C]  (value not drawn)
Q708  3b9c635fedb024a5347a57b145af9cc  [FP-S-03946-IPC_C]  (value not drawn)
Q709  3b9c635fedb024a5347a57b145af9cc  [FP-S-03946-IPC_C]  (value not drawn)
Q710  3b9c635fedb024a5347a57b145af9cc  [FP-S-03946-IPC_C]  (value not drawn)
R701  RC0603FR-075K6L  [RESC1608X55X25NL10T15]  (value not drawn)
R702  RC0603FR-075K6L  [RESC1608X55X25NL10T15]  (value not drawn)
R703  RC0603FR-075K6L  [RESC1608X55X25NL10T15]  (value not drawn)
R704  RC0603FR-075K6L  [RESC1608X55X25NL10T15]  (value not drawn)
R705  470  [R_0603_1608Metric_Pad0.98x0.95mm_HandSolder]
R706  470  [R_0603_1608Metric_Pad0.98x0.95mm_HandSolder]
R707  470  [R_0603_1608Metric_Pad0.98x0.95mm_HandSolder]
R708  RC0603FR-075K6L  [RESC1608X55X25NL10T15]  (value not drawn)
U701  ULN2803A_DW_18  [DW18]

### Ports
IN1 (in), IN2 (in), IN3 (in), IN4 (in), IN5 (in), IN6 (in), IN7 (in), IN8 (in)

### Nets
+5V: R705.2 R706.2 R707.2
+12V: Q701.3(D) Q702.3(D) Q703.3(D) Q704.3(D) Q705.3(D) Q706.3(D) Q707.3(D) Q708.3(D) Q709.3(D) Q710.3(D) R701.2 R702.2 R703.2 R704.2 R708.2
GNDD: J701.2 J701.4 J701.6 J701.8 J701.10 U701.9(GND)
IN1: U701.1(1B) ; port IN1
IN2: U701.2(2B) ; port IN2
IN3: U701.3(3B) ; port IN3
IN4: U701.4(4B) ; port IN4
IN5: U701.5(5B) ; port IN5
IN6: U701.6(6B) ; port IN6
IN7: U701.7(7B) ; port IN7
IN8: U701.8(8B) ; port IN8
NetJ701_1: J701.1 Q701.2(S) Q702.2(S)
NetJ701_3: J701.3 Q703.2(S) Q704.2(S)
NetJ701_5: J701.5 Q705.2(S) Q706.2(S)
NetJ701_7: J701.7 Q707.2(S) Q708.2(S)
NetJ701_9: J701.9 Q709.2(S) Q710.2(S)
NetLED701_1: LED701.1 U701.13(6C)
NetLED701_2: LED701.2 R705.1
NetLED702_1: LED702.1 U701.12(7C)
NetLED702_2: LED702.2 R706.1
NetLED703_1: LED703.1 U701.11(8C)
NetLED703_2: LED703.2 R707.1
NetQ701_1: Q701.1(G) Q702.1(G) R701.1 U701.18(1C)
NetQ703_1: Q703.1(G) Q704.1(G) R702.1 U701.17(2C)
NetQ705_1: Q705.1(G) Q706.1(G) R703.1 U701.16(3C)
NetQ707_1: Q707.1(G) Q708.1(G) R704.1 U701.15(4C)
NetQ709_1: Q709.1(G) Q710.1(G) R708.1 U701.14(5C)

Not connected (* = marked no-connect by the designer): U701 10(COM)

### Notes on the sheet
- THIS DOCUMENT AND THE DATA DISCLOSED HEREIN OR
- HEREWITH IS THE PROPERTY OF TEAM HAYA OFF ROADING AND MAY
- NOT BE FREELY DISTRIBUTED IN WHOLE. ALL RIGHTS ARE
- RESERVED AND NO EXPRESS OR IMPLIED WARANTEE IS GIVEN.

### Library data of the parts
J701 = 1924389: Mfr_Name: Phoenix Contact; Part Reference: J1; PCB Footprint: CONN_1924389_PXC; Copyright: Copyright (C) 2025 Ultra Librarian. All rights reserved.; Manufacturer_Part_Number: 1924389; Value: CONN_1924389; Part Number: 1924389; Manufacturer Part Number: 1924389; Manufacturer Name: Phoenix Contact
LED701 = QTLP600C3TR: https://sharvielectronics.com/product/yellow-led-17-21uyc-s530-a2-tr8-0805-package/; Mfr_Name: Everlight; Part Reference: LED1; PCB Footprint: LED_QTLP600C_EVE; Manufacturer_Part_Number: QTLP600C3TR; Copyright: Copyright (C) 2025 Ultra Librarian. All rights reserved.; Value: LED; Manufacturer Name: Everlight; Manufacturer Part Number: QTLP600C3TR; Part Number: QTLP600C3TR
LED702 = QTLP600C3TR: https://sharvielectronics.com/product/yellow-led-17-21uyc-s530-a2-tr8-0805-package/; Mfr_Name: Everlight; Part Reference: LED2; PCB Footprint: LED_QTLP600C_EVE; Manufacturer_Part_Number: QTLP600C3TR; Copyright: Copyright (C) 2025 Ultra Librarian. All rights reserved.; Value: LED; Manufacturer Name: Everlight; Manufacturer Part Number: QTLP600C3TR; Part Number: QTLP600C3TR
LED703 = QTLP600C3TR: https://sharvielectronics.com/product/yellow-led-17-21uyc-s530-a2-tr8-0805-package/; Mfr_Name: Everlight; Part Reference: LED3; PCB Footprint: LED_QTLP600C_EVE; Manufacturer_Part_Number: QTLP600C3TR; Copyright: Copyright (C) 2025 Ultra Librarian. All rights reserved.; Value: LED; Part Number: QTLP600C3TR; Manufacturer Part Number: QTLP600C3TR; Manufacturer Name: Everlight
Q701-Q710 = CMP-02550-000051-1: MOSFET N-CH 100V 1.15A SOT23-3; Manufacturer Part Number: SI2328DS-T1-E3; Manufacturer: Vishay; Pulse Drain Current: 6A; Reverse Recovery Time: 50ns; Max Forward Diode Voltage: 1.2V; Number Of Channels: 1; Transconductance: 4S; Standoff Height: 0.01mm; Max Junction Temp: +150°C; Threshold Vgs Min: 2V; Rthja Max: 130°C/W; Drain To Source Resistance: 0.195Ω; Turn On Delay Time: 7ns; Gate To Source Voltage: 20V; Depletion Mode: False; Threshold Vgs Max: 4V; Turn Off Delay Time: 9ns; Typ Forward Diode Voltage: 0.8V; Gate Charge At Vgs: 3.3nC @ 10V; Power Dissipation: 0.73W; Height: 1.12mm; Device Class L1: Discrete Semiconductors; Digikey Description: MOSFET N-CH 100V 1.15A SOT23-3; RoHS: TRUE; Temperature Range Low: -55°C; ComponentLink2URL: http://www.vishay.com/docs/71796/si2328ds.pdf; Octopart: https://octopart.com/si2328ds-t1-e3-vishay-40951139; Drain To Source Voltage: 100V; Lead Free: Yes; Continuous Drain Current: 1.15A; ComponentLink2Description: Datasheet; Package: S-03946; Automotive: No; Mouser Description: MOSFET 100V 1.5A; Device Class L3: MOSFETs; Temperature: -55°C to +150°C; Temperature Range High: +150°C; Device Class L2: Transistors; Ipc Land Pattern Name: SOT95P237X100-3; Drain To Source Breakdown Voltage: 100V; Category: Trans; Number Of N Channels: 1
R701-R704 R708 = CMP-1012-00595-2: Chip Resistor, 5.6 KOhm, +/- 1%, 0.1 W, -55 to 155 degC, 0603 (1608 Metric), RoHS, Tape and Reel; Voltage Rating: 50 V; Case\Package: 0603; Power Rating: 100 mW; Type (Resistor): Thick Film; Resistance: 332 kohm; ComponentLink1Description: Manufacturer URL; Case Code (Metric): 1608; Height: 0.45 mm; Min Operating Temperature: -55 degC; RoHSCompliant: true; ComponentLink2URL: http://www.yageo.com/documents/recent/PYu-RC_Group_51_RoHS_L_04.pdf; Length: 1.6 mm; ComponentLink2Description: Datasheet; Width: 0.8 mm; PackageReference: 0603; DatasheetVersion: Rev. 4, 02/2016; Package Quantity: 5000; Tolerance: 1%; Case Code (Imperial): 0603; PackageDescription: 2-Pin Surface Mount Device, Body 1.6 x 0.8 mm; ComponentLink1URL: http://www.yageo.com/; Max Operating Temperature: 155 degC; Packaging: Tape and Reel
R705 = CRGCQ0402F100K: Manufacturer_Part_Number: RCT02470RF; Mfr_Name: Unified Resistive Technologies; Part Reference: R1; PCB Footprint: RES_CRGCQ0402F100K_TEC; Copyright: Copyright (C) 2025 Ultra Librarian. All rights reserved.; Value: 470; Part Number: RCT02470RF; Manufacturer Part Number: RCT02470RF
R706 = CRGCQ0402F100K: Manufacturer_Part_Number: RCT02470RF; Mfr_Name: Unified Resistive Technologies; Part Reference: R2; PCB Footprint: RES_CRGCQ0402F100K_TEC; Copyright: Copyright (C) 2025 Ultra Librarian. All rights reserved.; Value: 470; Manufacturer Part Number: RCT02470RF; Part Number: RCT02470RF
R707 = CRGCQ0402F100K: Manufacturer_Part_Number: RCT02470RF; Mfr_Name: Unified Resistive Technologies; Part Reference: R3; PCB Footprint: RES_CRGCQ0402F100K_TEC; Copyright: Copyright (C) 2025 Ultra Librarian. All rights reserved.; Value: 470; Part Number: RCT02470RF; Manufacturer Part Number: RCT02470RF
U701 = ULN2803ADW: Mfr_Name: Texas Instruments; Part Reference: U4; Manufacturer_Part_Number: ULN2803ADW; Copyright: Copyright (C) 2025 Ultra Librarian. All rights reserved.; Value: ULN2803A_DW_18; PCB Footprint: DW18; Part Number: ULN2803ADW; Manufacturer Part Number: ULN2803ADW; Manufacturer Name: Texas Instruments

## Nets that join several sheets
+3.3V: CAR PCB (10 pins), Microcontroller (9 pins)
+5V: CAR PCB (R102.1 U102.4), Display (J501.4), RF Sheet (9 pins), CAN_Module (R602.2 U601.18 U602.3), LORA (C401.1 J401.6), ULN2803+MOSFETS (R705.2 R706.2 R707.2)
+12V: CAR PCB (#FLG0103.1 J101.1 U101.1 U102.1), ULN2803+MOSFETS (15 pins)
GNDA: CAR PCB (AE101.2 R103.2 R104.2), RF Sheet (14 pins)
GNDD: CAR PCB (18 pins), Display (J501.1), CAN_Module (5 pins), LORA (C401.2 J401.7), Microcontroller (32 pins), ULN2803+MOSFETS (6 pins)
ANTENNA_LINE: CAR PCB (AE101.1), RF Sheet (U201.12)
CS: CAN_Module (U601.16), Microcontroller (U301.35)
GPIO_LORA_1: LORA (J401.2), Microcontroller (U301.15)
GPIO_LORA_2: LORA (J401.1), Microcontroller (U301.14)
I2C_SCL_1: CAR PCB (U103.15 U104.15), Microcontroller (U301.17)
I2C_SDA_1: CAR PCB (U103.14 U104.14), Microcontroller (U301.18)
IN1: CAR PCB (U103.4), ULN2803+MOSFETS (U701.1)
IN2: CAR PCB (U103.5), ULN2803+MOSFETS (U701.2)
IN3: CAR PCB (U103.6), ULN2803+MOSFETS (U701.3)
IN4: CAR PCB (U103.7), ULN2803+MOSFETS (U701.4)
IN5: CAR PCB (U103.9), ULN2803+MOSFETS (U701.5)
IN6: CAR PCB (U103.10), ULN2803+MOSFETS (U701.6)
IN7: CAR PCB (U103.11), ULN2803+MOSFETS (U701.7)
IN8: CAR PCB (U103.12), ULN2803+MOSFETS (U701.8)
MISO: CAN_Module (U601.15), Microcontroller (U301.22)
MOSI: CAN_Module (U601.14), Microcontroller (U301.23)
PCF_INT: CAR PCB (U104.13), Microcontroller (U301.34)
SCK: CAN_Module (U601.13), Microcontroller (U301.21)
UART1_RX: Display (J501.2), Microcontroller (U301.11)
UART1_TX: Display (J501.3), Microcontroller (U301.10)
UART2_RX: RF Sheet (U201.17), Microcontroller (J302.16 U301.32)
UART2_TX: RF Sheet (U201.16), Microcontroller (J302.17 U301.31)
UART6_RX: LORA (J401.4), Microcontroller (U301.13)
UART6_TX: LORA (J401.3), Microcontroller (U301.12)